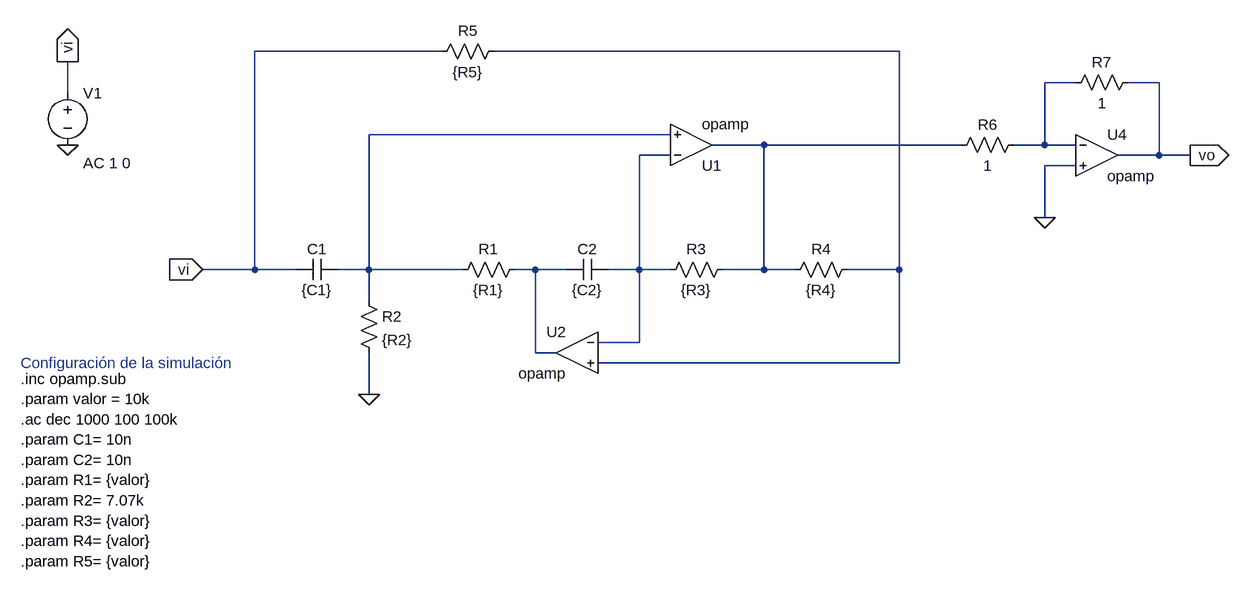
[diagram p0: schematic 20230726 - Ejercicio 1 - item e.asc]
20230726 - Ejercicio 1 - item e.asc, the LTspice schematic file:
Version 4
SHEET 1 1416 968
WIRE 144 112 -144 112
WIRE 848 112 224 112
WIRE 1120 160 1072 160
WIRE 1248 160 1200 160
WIRE -432 176 -432 128
WIRE 496 240 32 240
WIRE 640 256 560 256
WIRE 944 256 640 256
WIRE 1072 256 1072 160
WIRE 1072 256 1024 256
WIRE 1120 256 1072 256
WIRE 496 272 448 272
WIRE 1248 272 1248 160
WIRE 1248 272 1184 272
WIRE 1296 272 1248 272
WIRE 1120 288 1072 288
WIRE 1072 368 1072 288
WIRE -144 448 -144 112
WIRE -144 448 -224 448
WIRE -80 448 -144 448
WIRE 32 448 32 240
WIRE 32 448 -16 448
WIRE 176 448 32 448
WIRE 288 448 256 448
WIRE 336 448 288 448
WIRE 448 448 448 272
WIRE 448 448 400 448
WIRE 496 448 448 448
WIRE 640 448 640 256
WIRE 640 448 576 448
WIRE 688 448 640 448
WIRE 848 448 848 112
WIRE 848 448 768 448
WIRE 32 496 32 448
WIRE 448 560 448 448
WIRE 448 560 384 560
WIRE 288 576 288 448
WIRE 320 576 288 576
WIRE 848 592 848 448
WIRE 848 592 384 592
WIRE 32 640 32 576
FLAG 32 640 0
FLAG -224 448 vi
IOPIN -224 448 In
FLAG 1296 272 vo
IOPIN 1296 272 Out
FLAG -432 256 0
FLAG -432 128 vi
IOPIN -432 128 Out
FLAG 1072 368 0
SYMBOL res 240 96 R90
WINDOW 0 0 56 VBottom 2
WINDOW 3 32 56 VTop 2
SYMATTR InstName R5
SYMATTR Value {R5}
SYMBOL OpAmps\\opamp 528 320 M180
SYMATTR InstName U1
SYMBOL OpAmps\\opamp 352 512 M0
SYMATTR InstName U2
SYMBOL cap -16 432 R90
WINDOW 0 0 32 VBottom 2
WINDOW 3 32 32 VTop 2
SYMATTR InstName C1
SYMATTR Value {C1}
SYMATTR SpiceLine Rser=0 Lser=0 Rpar=0
SYMBOL res 16 480 R0
SYMATTR InstName R2
SYMATTR Value {R2}
SYMBOL res 272 432 R90
WINDOW 0 0 56 VBottom 2
WINDOW 3 32 56 VTop 2
SYMATTR InstName R1
SYMATTR Value {R1}
SYMBOL res 592 432 R90
WINDOW 0 0 56 VBottom 2
WINDOW 3 32 56 VTop 2
SYMATTR InstName R3
SYMATTR Value {R3}
SYMBOL res 784 432 R90
WINDOW 0 0 56 VBottom 2
WINDOW 3 32 56 VTop 2
SYMATTR InstName R4
SYMATTR Value {R4}
SYMBOL cap 400 432 R90
WINDOW 0 0 32 VBottom 2
WINDOW 3 32 32 VTop 2
SYMATTR InstName C2
SYMATTR Value {C2}
SYMATTR SpiceLine Rser=0 Lser=0 Rpar=0
SYMBOL voltage -432 160 R0
WINDOW 123 24 124 Left 2
WINDOW 39 24 152 Left 2
SYMATTR Value2 AC 1 0
SYMATTR InstName V1
SYMATTR Value ""
SYMBOL res 1040 240 R90
WINDOW 0 0 56 VBottom 2
WINDOW 3 32 56 VTop 2
SYMATTR InstName R6
SYMATTR Value 1
SYMBOL res 1216 144 R90
WINDOW 0 0 56 VBottom 2
WINDOW 3 32 56 VTop 2
SYMATTR InstName R7
SYMATTR Value 1
SYMBOL OpAmps\\opamp 1152 208 R0
SYMATTR InstName U4
TEXT -504 592 Left 2 ;Configuración de la simulación
TEXT -504 616 Left 2 !.inc opamp.sub\n.param valor = 10k\n.ac dec 1000 100 100k\n.param C1= 10n\n.param C2= 10n\n.param R1= {valor}\n.param R2= 7.07k\n.param R3= {valor}\n.param R4= {valor}\n.param R5= {valor}

The netlist it stands for:
* 20230726 - Ejercicio 1 - item e.asc
R5 N001 vi {R5}
XU1 N005 N003 N004 opamp Aol=100K GBW=10Meg  ; pins invin noninvin out
XU2 N005 N001 N006 opamp Aol=100K GBW=10Meg  ; pins invin noninvin out
C1 N003 vi {C1} Rser=0 Lser=0 Rpar=0
R2 N003 0 {R2}
R1 N006 N003 {R1}
R3 N004 N005 {R3}
R4 N001 N004 {R4}
C2 N005 N006 {C2} Rser=0 Lser=0 Rpar=0
V1 vi 0 AC 1 0
R6 N002 N004 1
R7 vo N002 1
XU4 N002 0 vo opamp Aol=100K GBW=10Meg  ; pins invin noninvin out
* Configuración de la simulación
.inc opamp.sub
.param valor = 10k
.ac dec 1000 100 100k
.param C1= 10n
.param C2= 10n
.param R1= {valor}
.param R2= 7.07k
.param R3= {valor}
.param R4= {valor}
.param R5= {valor}
.backanno
.end